# Altium schematic sheet AMS_Master.SchDoc
size A4; DocumentNumber: 0; SheetNumber: 1; SheetTotal: 10
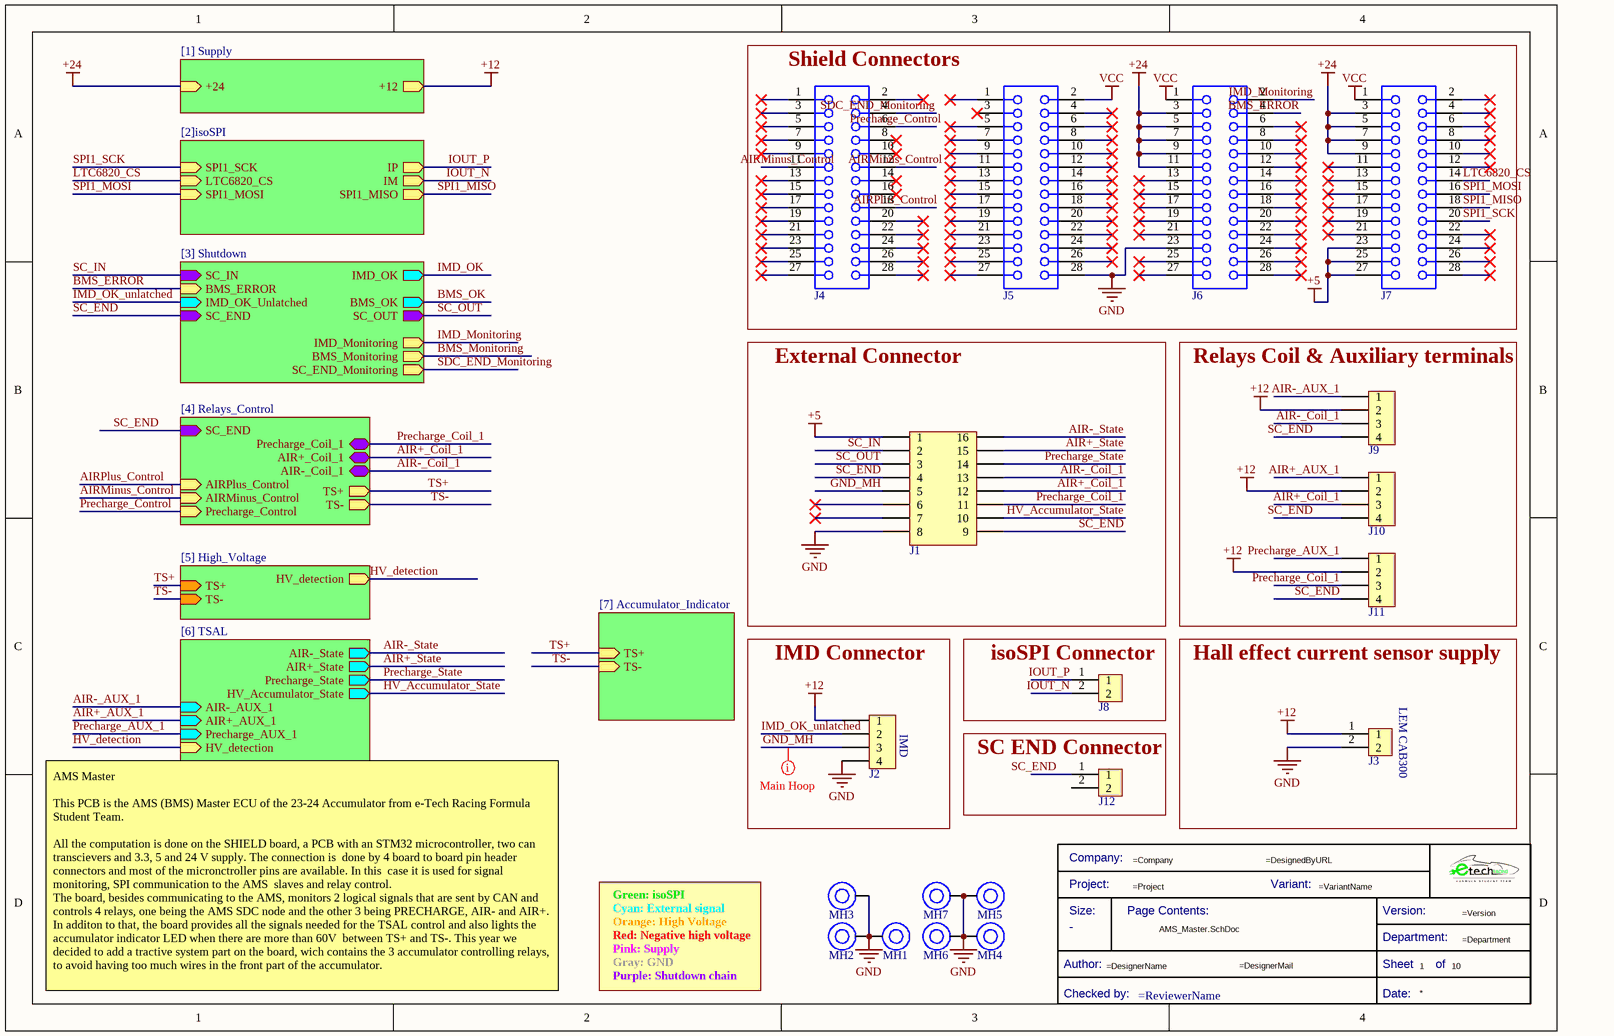
[diagram p0: AMS_Master.SchDoc]

## Parts
*?  Title Block_template  (value not drawn)  (graphical)
J1  1053101116  [J_NanoFit_2x8_V]  (value not drawn)
J2  1053091204  [J_NanoFit_1x4_V]  (value not drawn)
J3  436500215  [J_MicroFit_2x1]  (value not drawn)
J4  62202821821  [62202821821]  (value not drawn)
J5  62202821821  [62202821821]  (value not drawn)
J6  62202821821  [62202821821]  (value not drawn)
J7  62202821821  [62202821821]  (value not drawn)
J8  436500215  [J_MicroFit_2x1]  (value not drawn)
J9  1053091204  [J_NanoFit_1x4_V - duplicate]  (value not drawn)
J10  1053091204  [J_NanoFit_1x4_V - duplicate]  (value not drawn)
J11  1053091204  [J_NanoFit_1x4_V - duplicate]  (value not drawn)
J12  436500215  [J_MicroFit_2x1]  (value not drawn)
MH1  Mounting_Hole_M4  [Mounting_Hole_M4]  (value not drawn)
MH2  Mounting_Hole_M4  [Mounting_Hole_M4]  (value not drawn)
MH3  Mounting_Hole_M4  [Mounting_Hole_M4]  (value not drawn)
MH4  Mounting_Hole_M4  [Mounting_Hole_M4]  (value not drawn)
MH5  Mounting_Hole_M4  [Mounting_Hole_M4]  (value not drawn)
MH6  Mounting_Hole_M4  [Mounting_Hole_M4]  (value not drawn)
MH7  Mounting_Hole_M4  [Mounting_Hole_M4]  (value not drawn)

## Blocks framed on the sheet
Shield Connectors: J4-J7
External Connector: J1
Relays Coil & Auxiliary terminals: J9-J11
IMD Connector: J2
isoSPI Connector: J8
Hall effect current sensor supply: J3
SC END Connector: J12

## Sub-sheets
Designator = [7] Accumulator_Indicator: TS+ (in), TS- (in)
High_Voltage = [5] High_Voltage: HV_detection (out), TS- (in), TS+ (in)
isoSPI = [2]isoSPI: SPI1_SCK (in), LTC6820_CS (in), SPI1_MOSI (in), SPI1_MISO (out), IP (out), IM (out)
Relays_Control = [4] Relays_Control: Precharge_Coil_1 (bidir), AIR+_Coil_1 (bidir), AIR-_Coil_1 (bidir), AIRPlus_Control (in), AIRMinus_Control (in), Precharge_Control (in), SC_END (in), TS+ (out), TS- (out)
Shutdown = [3] Shutdown: BMS_ERROR (in), SC_IN (in), BMS_OK (out), IMD_OK (out), IMD_OK_Unlatched (in), BMS_Monitoring (out), IMD_Monitoring (out), SC_OUT (out), SC_END (in), SC_END_Monitoring (out)
Supply = [1] Supply: +24 (in), +12 (out)
TSAL = [6] TSAL: Precharge_State (out), AIR-_State (out), AIR+_State (out), HV_Accumulator_State (out), HV_detection (in), AIR-_AUX_1 (in), AIR+_AUX_1 (in), Precharge_AUX_1 (in)

## Nets
+5: J1.1 J7.23 J7.25 J7.27
+12: J2.1 J3.1 J9.2 J10.2 J11.2 ; sheet Supply/+12
+24: J6.3 J6.5 J6.7 J6.9 J6.11 J7.3 J7.5 J7.7 J7.9 ; sheet Supply/+24
GND: J1.8 J2.4 J3.2 J5.28 J6.23 MH1.1 MH2.1 MH3.1 MH4.1 MH5.1 MH6.1 MH7.1
VCC: J5.2 J6.1 J7.1
AIR+_AUX_1: J10.1 ; sheet TSAL/AIR+_AUX_1
AIR+_Coil_1: J1.12 J10.3 ; sheet Relays_Control/AIR+_Coil_1
AIR+_State: J1.15 ; sheet TSAL/AIR+_State
AIR-_AUX_1: J9.1 ; sheet TSAL/AIR-_AUX_1
AIR-_Coil_1: J1.13 J9.3 ; sheet Relays_Control/AIR-_Coil_1
AIR-_State: J1.16 ; sheet TSAL/AIR-_State
AIRMinus_Control: J4.11 J4.12 ; sheet Relays_Control/AIRMinus_Control
AIRPlus_Control: J4.18 ; sheet Relays_Control/AIRPlus_Control
BMS_ERROR: J6.4 ; sheet Shutdown/BMS_ERROR
BMS_Monitoring: sheet Shutdown/BMS_Monitoring
BMS_OK: sheet Shutdown/BMS_OK
GND_MH: J1.5 J2.3
HV_Accumulator_State: J1.10 ; sheet TSAL/HV_Accumulator_State
HV_detection: sheet High_Voltage/HV_detection, sheet TSAL/HV_detection
IMD_Monitoring: J6.2 ; sheet Shutdown/IMD_Monitoring
IMD_OK: sheet Shutdown/IMD_OK
IMD_OK_unlatched: J2.2 ; sheet Shutdown/IMD_OK_Unlatched
IOUT_N: J8.2 ; sheet isoSPI/IM
IOUT_P: J8.1 ; sheet isoSPI/IP
LTC6820_CS: J7.14 ; sheet isoSPI/LTC6820_CS
Precharge_AUX_1: J11.1 ; sheet TSAL/Precharge_AUX_1
Precharge_Coil_1: J1.11 J11.3 ; sheet Relays_Control/Precharge_Coil_1
Precharge_Control: J4.6 ; sheet Relays_Control/Precharge_Control
Precharge_State: J1.14 ; sheet TSAL/Precharge_State
SC_END: J1.4 J1.9 J9.4 J10.4 J11.4 J12.1 ; sheet Shutdown/SC_END, sheet Relays_Control/SC_END
SC_IN: J1.2 ; sheet Shutdown/SC_IN
SC_OUT: J1.3 ; sheet Shutdown/SC_OUT
SDC_END_Monitoring: J4.4 ; sheet Shutdown/SC_END_Monitoring
SPI1_MISO: J7.18 ; sheet isoSPI/SPI1_MISO
SPI1_MOSI: J7.16 ; sheet isoSPI/SPI1_MOSI
SPI1_SCK: J7.20 ; sheet isoSPI/SPI1_SCK
TS+: sheet High_Voltage/TS+, sheet Relays_Control/TS+, sheet Designator/TS+
TS-: sheet High_Voltage/TS-, sheet Relays_Control/TS-, sheet Designator/TS-

Not connected (* = marked no-connect by the designer): J1 6* 7*; J4 1* 2* 3* 5* 7* 8* 9* 10* 13* 14* 15* 16* 17* 19* 20* 21* 22* 23* 24* 25* 26* 27* 28*; J5 1* 3* 4* 5* 6* 7* 8* 9* 10* 11* 12* 13* 14* 15* 16* 17* 18* 19* 20* 21* 22* 23* 24* 25* 26* 27*; J6 6* 8* 10* 12* 13* 14* 15* 16* 17* 18* 19* 20* 21* 22* 24* 25* 26* 27* 28*; J7 2* 4* 6* 8* 10* 11* 12* 13* 15* 17* 19* 21* 22* 24* 26* 28*; J12 2

## Layout directives
mark named Main Hoop: GND_MH

## Notes on the sheet
- (near J3) LEM CAB300
- (near J2) IMD
- Cyan: External signal
- Orange: High Voltage
- Green: isoSPI
- AMS Master
  This PCB is the AMS (BMS) Master ECU of the 23-24 Accumulator from e-Tech Racing Formula Student Team.
  All the computation is done on the SHIELD board, a PCB with an STM32 microcontroller, two can transcievers and 3.3, 5 and 24 V supply. The connection is  done by 4 board to board pin header connectors and most of the micronctroller pins are available. In this  case it is used for signal monitoring, SPI communication to the AMS  slaves and relay control.
  The board, besides communicating to the AMS, monitors 2 logical signals that are sent by CAN and controls 4 relays, one being the AMS SDC node and the other 3 being PRECHARGE, AIR- and AIR+.
  In additon to that, the board provides all the signals needed for the TSAL control and also lights the accumulator indicator LED when there are more than 60V  between TS+ and TS-. This year we decided to add a tractive system part on the board, wich contains the 3 accumulator controlling relays, to avoid having too much wires in the front part of the accumulator.
- Red: Negative high voltage
- Gray: GND
- Pink: Supply
- Purple: Shutdown chain
- Title
- Size:
- Date:
- A4
- Number:
- Time:
- Revision:
- Sheet
- of
- File:
- (in symbol Title Block_template) Company:; Project:; Variant:; Size:; Page Contents:; Version:; Department:; Author:; Sheet; of; Checked by:; Date:

## Library data of the parts
*? = Title Block_template: Standard Title Block; Category: Title Block; Checked by:: =ReviewerName; Size: -
J1 = J_NanoFit_2x8_V: Nano-Fit Vertical Header Through Hole 2.50mm Pitch Dual Row 16 Circuits with Kinked Pins Tin (Sn) Plating Black; Manufacturer 1: Molex; Manufacturer Part Number 1: 105310-1116; Connector Type: Header,Male Pin; Number of Positions: 16; .Creator: AC; Supplier 1: Digi-Key; RoHS: No; Category: Headers and Wire Housings; Stock 1: 84; Pricing 1: 1=3,21000, 10=2,82400, 84=2,24619, 1008=1,86110, 4956=1,66858 (USD); Mount: Through Hole; Contact Plating: Tin; Contact Material: Brass; Contact Shape: Square; Insulation Material: Polymer; Insulation Color: Black; Min Operating Temperature: -40°C; Max Operating Temperature: 105°C; Fastening Type: Latch; Packaging: Tray; Number of Rows: 2; Termination: Kinked Pin; ComponentLink1URL: https://www.molex.com/pdm_docs/sd/1053101210_sd.pdf?src-supplier=Digi-Key; ComponentLink1Description: https://www.molex.com/pdm_docs/sd/1053101210_sd.pdf?src-supplier=Digi-Key; Supplier Part Number 1: WM16885-ND; ComponentLink2Description: Molex; ComponentLink2URL: https://www.molex.com/molex/products/part-detail/pcb_headers/1053101116
J2 J9-J11 = J_NanoFit_1x4_V: Nano-Fit Vertical Header Through Hole 2.50mm Pitch Single Row 4 Circuits with Kinked Pins 0.38; Manufacturer 1: Molex; Manufacturer Part Number 1: 105309-1204; .Creator: DO; Supplier 1: Arrow Electronics; RoHS: No; Category: Headers and Wire Housings; Stock 1: 709; Pricing 1: 1=1,37050, 10=1,11700, 100=0,95270, 500=0,86980, 1000=0,74060, 2500=0,71930, 5000=0,68450, 10000=0,66860 (USD); ComponentLink1URL: http://farnell.com//datasheets/2221349.pdf?src-supplier=Farnell; ComponentLink1Description: http://farnell.com//datasheets/2221349.pdf?src-supplier=Farnell; ComponentLink2URL: http://www.farnell.com/datasheets/2221349.pdf?src-supplier=Newark; ComponentLink2Description: http://www.farnell.com/datasheets/2221349.pdf?src-supplier=Newark; ComponentLink3URL: http://www.literature.molex.com/SQLImages/kelmscott/Molex/PDF_Images/987651-1223.PDF?src-supplier=Digi-Key; ComponentLink3Description: http://www.literature.molex.com/SQLImages/kelmscott/Molex/PDF_Images/987651-1223.PDF?src-supplier=Digi-Key; ComponentLink4URL: http://www.farnell.com/datasheets/2059602.pdf?src-supplier=Element14; ComponentLink4Description: http://www.farnell.com/datasheets/2059602.pdf?src-supplier=Element14; Supplier Part Number 1: 105309-1204
J3 J8 J12 = J_MicroFit_2x1: Header 1 Row Vertical Polarizing Peg 2 Pin SMT/Glow Wire Compatible Tin Plate; Manufacturer 1: Molex; Manufacturer Part Number 1: 43650-0215; Supplier 1: Arrow Electronics; RoHS: Yes; Category: Headers and Wire Housings; Stock 1: 11086; Pricing 1: 1=0,87800, 10=0,74400, 80=0,63070, 3264=0,47000, 6528=0,45100, 13056=0,41760 (USD); ComponentLink1URL: https://datasheet.ciiva.com/19462/884109-19462034.pdf?src-supplier=Jameco; ComponentLink1Description: https://datasheet.ciiva.com/19462/884109-19462034.pdf?src-supplier=Jameco; ComponentLink2URL: https://datasheet.ciiva.com/5157/0436500215-pcb-headers-148687-5157608.pdf?src-supplier=Mouser; ComponentLink2Description: https://datasheet.ciiva.com/5157/0436500215-pcb-headers-148687-5157608.pdf?src-supplier=Mouser; ComponentLink3URL: https://datasheet.ciiva.com/16085/0436500215-pcb-headers-16085668.pdf?src-supplier=Onlinecomponents.com; ComponentLink3Description: https://datasheet.ciiva.com/16085/0436500215-pcb-headers-16085668.pdf?src-supplier=Onlinecomponents.com; ComponentLink4URL: https://datasheet.ciiva.com/11748/0900766b80307ce2-11748388.pdf?src-supplier=RSComponents; ComponentLink4Description: https://datasheet.ciiva.com/11748/0900766b80307ce2-11748388.pdf?src-supplier=RSComponents; ComponentLink5URL: https://datasheet.ciiva.com/9432/0436500215-pcb-headers-9432850.pdf?src-supplier=Avnet; ComponentLink5Description: https://datasheet.ciiva.com/9432/0436500215-pcb-headers-9432850.pdf?src-supplier=Avnet; ComponentLink6URL: https://datasheet.ciiva.com/7920/1889390-7920892.pdf?src-supplier=Element14; ComponentLink6Description: https://datasheet.ciiva.com/7920/1889390-7920892.pdf?src-supplier=Element14; Supplier Part Number 1: 43650-0215
J4-J7 = 62202821821: WR-PHD Socket Header, THT, Vertical, pitch 1.27mm, 2 Row, 28P; Manufacturer: Wurth Elektronik; Contact Resistance: 20mΩ; Rated Current: 1A; Working Voltage: 250V; Withstanding Voltage: 500V; ComponentLink1Description: Website Link; ComponentLink1URL: https://www.we-online.com/redexpert/article/62202821821?ad; ComponentLink2Description: Datasheet Link; ComponentLink2URL: https://www.we-online.com/redexpert/spec/62202821821?ad; Manufacturer Part Number: 62202821821; Category: Board-to-Board Connectors; Match Code: WR-PHD; Mount: Through Hole; Operating Temperature Max: 105°C; Operating Temperature Min: -40°C; Packaging: Tube; Gender: Socket Header; Number of Pins: 28; Number of Rows: 2; Orientation: Vertical; Pitch: 1.27mm